# Altium project Karman Delta Arm.PrjPcb
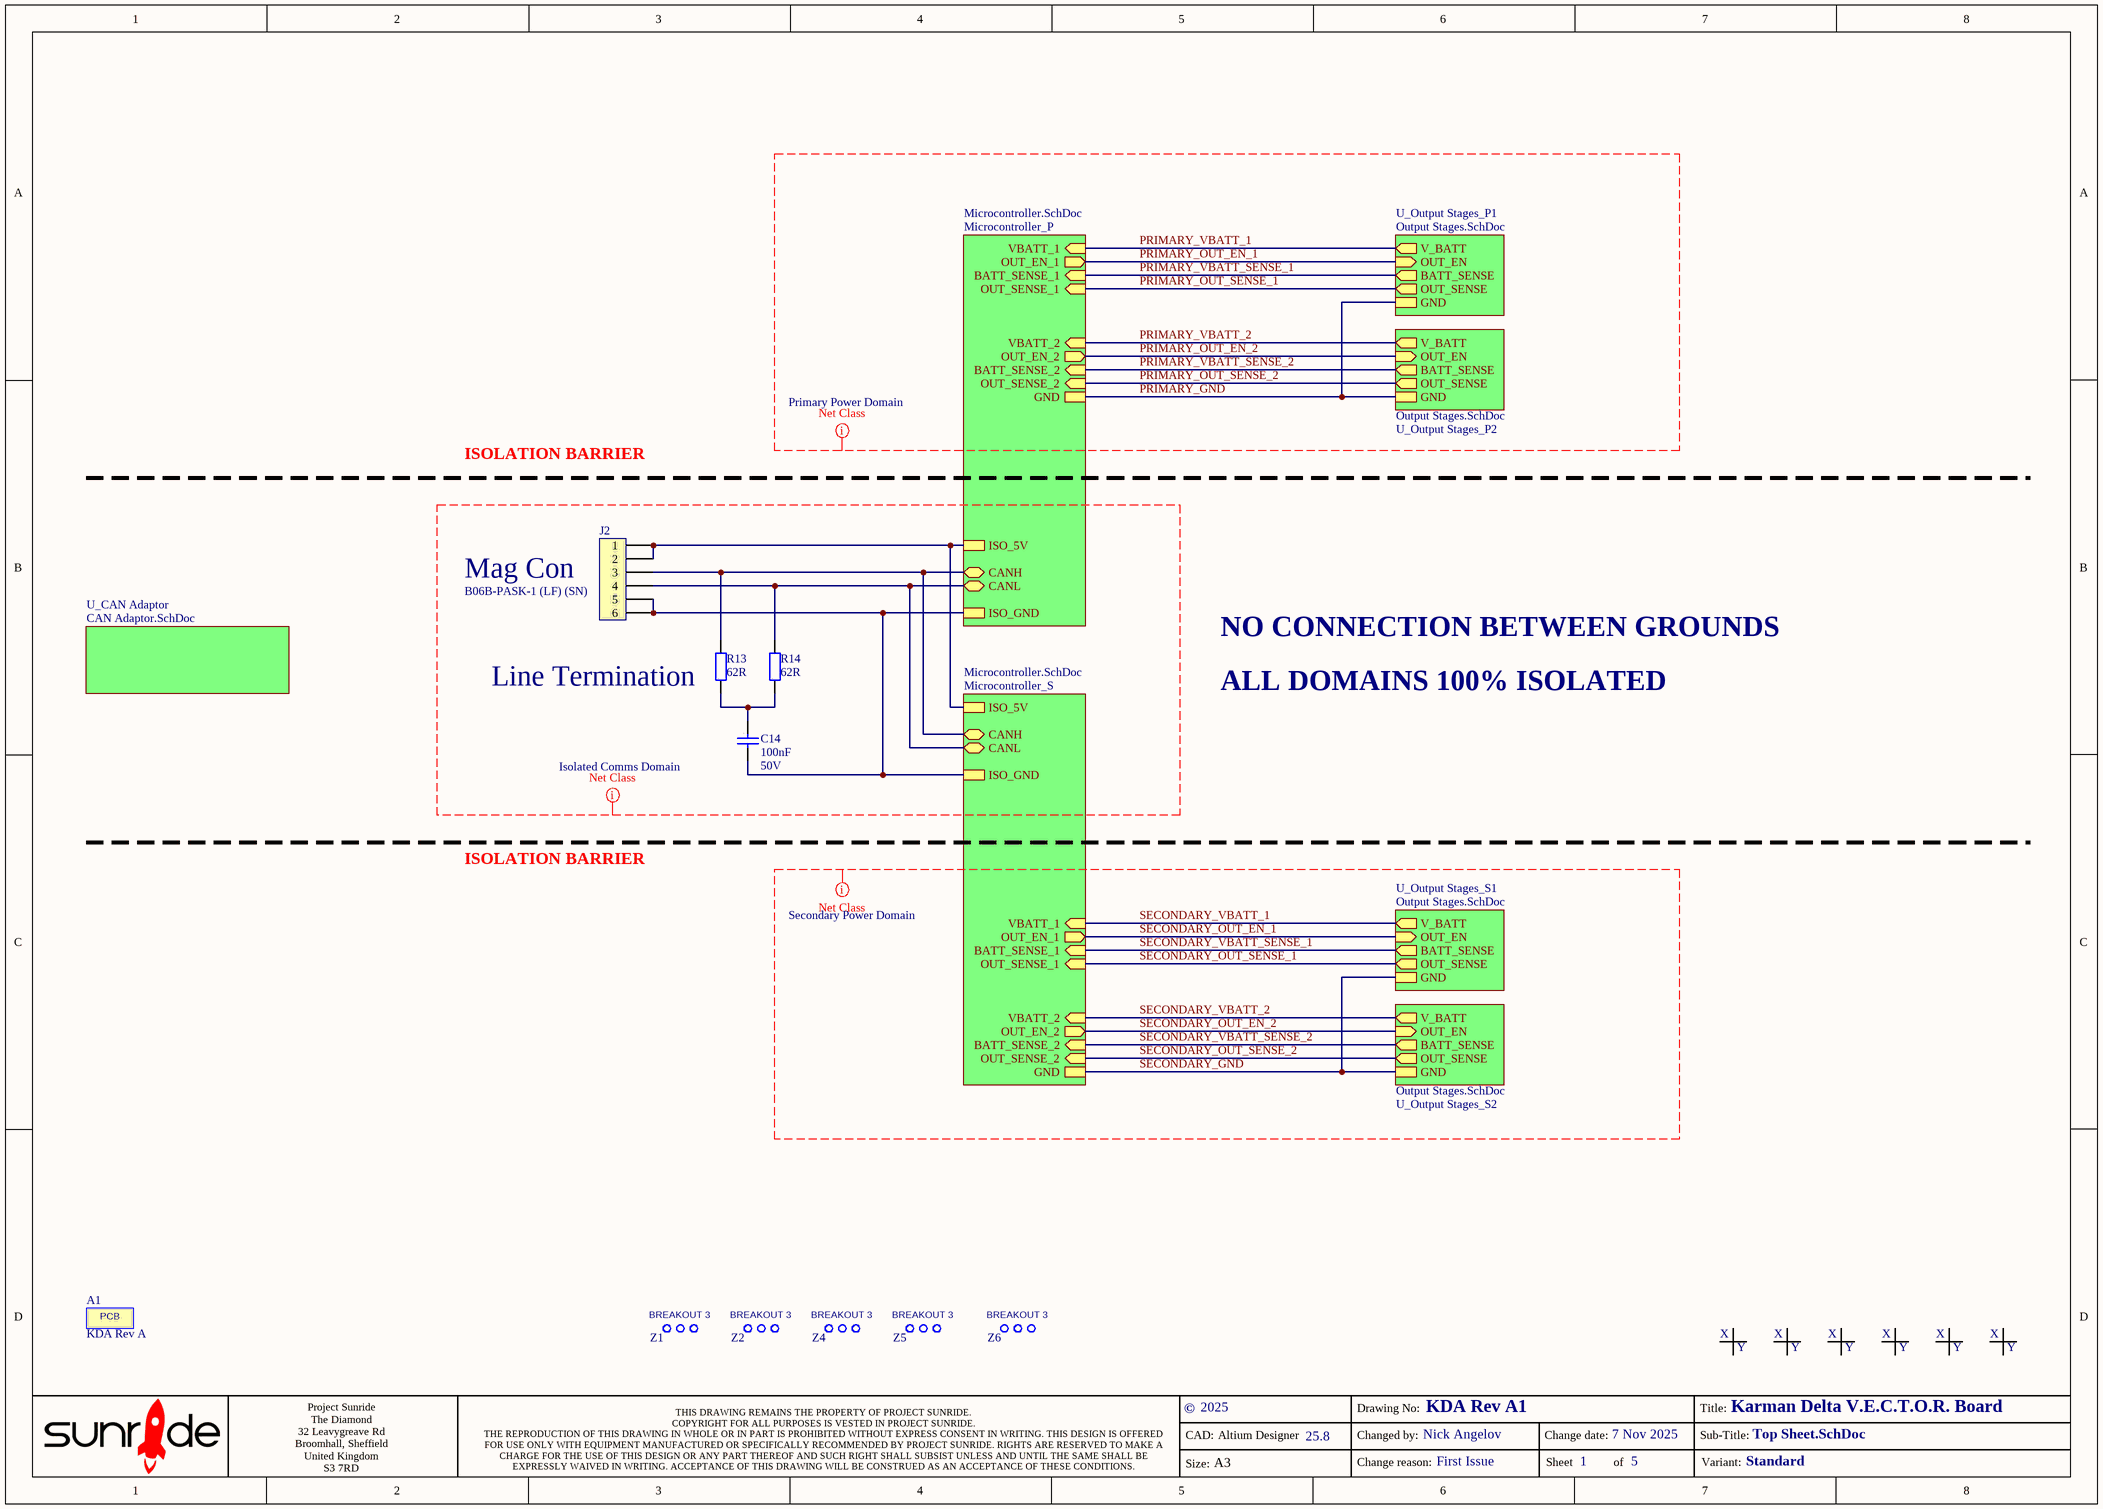
[diagram p0: Top Sheet.SchDoc]
a_AltiumVer: 25.8; a_AssemDwgNo: KDA Rev A1; a_AssemMbiNo: KDA Rev A1; a_BlockDiagramNo: -; a_BomNo: KDA Rev A1; a_CopyrightDate: 2025; a_PcbaNotesNo: -; a_PcbMbiNo: KDA Rev A1; a_PcbPartNo: KDA Rev A; a_PcbRevAuthor: Nick Angelov; a_PcbRevDate: 7 Nov 2025; a_PcbRevReason: ******; a_ReworkInstructionsNo: -; a_SchDwgNo: KDA Rev A1; a_SchRevAuthor: Nick Angelov; a_SchRevDate: 7 Nov 2025; a_SchRevReason: First Issue; a_SolderPasteStencilNo: -; a_TestSpecNo: -; a_Title: Karman Delta V.E.C.T.O.R. Board; a_Variant: Standard
5 sheets, 196 parts. Net scope: hierarchical (ports join the sheet entries above them; power ports are global).
Board files: Circular PCB - Radial.PcbDoc, PCB.PcbDoc, PCB - Rectangular.PcbDoc, PCB - Rectangular Longer.PcbDoc
Sheets:
  Top Sheet.SchDoc
    Microcontroller_P = Microcontroller.SchDoc
      U_Ancillaries = Ancillaries.SchDoc
    U_Output Stages_P1 = Output Stages.SchDoc
    U_Output Stages_P2 = Output Stages.SchDoc
    Microcontroller_S = Microcontroller.SchDoc
      U_Ancillaries = Ancillaries.SchDoc
    U_Output Stages_S1 = Output Stages.SchDoc
    U_Output Stages_S2 = Output Stages.SchDoc
    U_CAN Adaptor = CAN Adaptor.SchDoc

## Sheet Top Sheet.SchDoc
size A3; SheetNumber: 1; SheetTotal: 5

### Parts
A1  Supplier Part Number 1: KDA Rev A  [PCB]  (hidden comment: *)
C14  value 100nF  Voltage: 50V  [CAPC1608X08L]  (hidden comment: *)
FID1  *  [FIDRT]  (value not drawn)  (no BOM)
FID2  *  [FIDRT]  (value not drawn)  (no BOM)
FID3  *  [FIDRT]  (value not drawn)  (no BOM)
FID4  *  [FIDRT]  (value not drawn)  (no BOM)
FID5  *  [FIDRT]  (value not drawn)  (no BOM)
FID6  *  [FIDRT]  (value not drawn)  (no BOM)
J2  Mag Con  ManuPartNo: B06B-PASK-1 (LF) (SN)  [B06B-PASK-1]
R13  Line Termination  value 62R  [RESC1608X06L]
R14  value 62R  [RESC1608X06L]  (hidden comment: *)
Z1  *  [Breakout - 3 hole - short route]  (value not drawn)  (no BOM)
Z2  *  [Breakout - 3 hole - short route]  (value not drawn)  (no BOM)
Z4  *  [Breakout - 3 hole - short route]  (value not drawn)  (no BOM)
Z5  *  [Breakout - 3 hole - short route]  (value not drawn)  (no BOM)
Z6  *  [Breakout - 3 hole - short route]  (value not drawn)  (no BOM)

### Sub-sheets
Microcontroller_P = Microcontroller.SchDoc: OUT_EN_1 (out), OUT_EN_2 (out), BATT_SENSE_1 (in), BATT_SENSE_2 (in), VBATT_2 (in), VBATT_1 (in), OUT_SENSE_1 (in), OUT_SENSE_2 (in), CANH (bidir), CANL (bidir), GND, ISO_GND, ISO_5V
Microcontroller_S = Microcontroller.SchDoc: OUT_EN_1 (out), OUT_EN_2 (out), BATT_SENSE_1 (in), BATT_SENSE_2 (in), VBATT_2 (in), VBATT_1 (in), OUT_SENSE_1 (in), OUT_SENSE_2 (in), CANH (bidir), CANL (bidir), GND, ISO_GND, ISO_5V
U_CAN Adaptor = CAN Adaptor.SchDoc: no entries
U_Output Stages_P1 = Output Stages.SchDoc: OUT_EN (in), BATT_SENSE (out), V_BATT (out), OUT_SENSE (out), GND
U_Output Stages_P2 = Output Stages.SchDoc: OUT_EN (in), BATT_SENSE (out), V_BATT (out), OUT_SENSE (out), GND
U_Output Stages_S1 = Output Stages.SchDoc: OUT_EN (in), BATT_SENSE (out), V_BATT (out), OUT_SENSE (out), GND
U_Output Stages_S2 = Output Stages.SchDoc: OUT_EN (in), BATT_SENSE (out), V_BATT (out), OUT_SENSE (out), GND

### Nets
CANH: J2.3 R13.2 ; sheet Microcontroller_P/CANH, sheet Microcontroller_S/CANH
CANL: J2.4 R14.2 ; sheet Microcontroller_P/CANL, sheet Microcontroller_S/CANL
ISO_5V: J2.1 J2.2 ; sheet Microcontroller_P/ISO_5V, sheet Microcontroller_S/ISO_5V
ISO_GND: C14.2 J2.5 J2.6 ; sheet Microcontroller_P/ISO_GND, sheet Microcontroller_S/ISO_GND
PRIMARY_GND: sheet Microcontroller_P/GND, sheet U_Output Stages_P1/GND, sheet U_Output Stages_P2/GND  [project net GND]
PRIMARY_OUT_EN_1: sheet Microcontroller_P/OUT_EN_1, sheet U_Output Stages_P1/OUT_EN
PRIMARY_OUT_EN_2: sheet Microcontroller_P/OUT_EN_2, sheet U_Output Stages_P2/OUT_EN
PRIMARY_OUT_SENSE_1: sheet Microcontroller_P/OUT_SENSE_1, sheet U_Output Stages_P1/OUT_SENSE
PRIMARY_OUT_SENSE_2: sheet Microcontroller_P/OUT_SENSE_2, sheet U_Output Stages_P2/OUT_SENSE
PRIMARY_VBATT_1: sheet Microcontroller_P/VBATT_1, sheet U_Output Stages_P1/V_BATT
PRIMARY_VBATT_2: sheet Microcontroller_P/VBATT_2, sheet U_Output Stages_P2/V_BATT
PRIMARY_VBATT_SENSE_1: sheet Microcontroller_P/BATT_SENSE_1, sheet U_Output Stages_P1/BATT_SENSE
PRIMARY_VBATT_SENSE_2: sheet Microcontroller_P/BATT_SENSE_2, sheet U_Output Stages_P2/BATT_SENSE
SECONDARY_GND: sheet Microcontroller_S/GND, sheet U_Output Stages_S1/GND, sheet U_Output Stages_S2/GND  [project net GND]
SECONDARY_OUT_EN_1: sheet Microcontroller_S/OUT_EN_1, sheet U_Output Stages_S1/OUT_EN
SECONDARY_OUT_EN_2: sheet Microcontroller_S/OUT_EN_2, sheet U_Output Stages_S2/OUT_EN
SECONDARY_OUT_SENSE_1: sheet Microcontroller_S/OUT_SENSE_1, sheet U_Output Stages_S1/OUT_SENSE
SECONDARY_OUT_SENSE_2: sheet Microcontroller_S/OUT_SENSE_2, sheet U_Output Stages_S2/OUT_SENSE
SECONDARY_VBATT_1: sheet Microcontroller_S/VBATT_1, sheet U_Output Stages_S1/V_BATT
SECONDARY_VBATT_2: sheet Microcontroller_S/VBATT_2, sheet U_Output Stages_S2/V_BATT
SECONDARY_VBATT_SENSE_1: sheet Microcontroller_S/BATT_SENSE_1, sheet U_Output Stages_S1/BATT_SENSE
SECONDARY_VBATT_SENSE_2: sheet Microcontroller_S/BATT_SENSE_2, sheet U_Output Stages_S2/BATT_SENSE
NetC14_1: C14.1 R13.1 R14.1

### Layout directives
net class Primary Power Domain: PRIMARY_GND, PRIMARY_OUT_EN_1, PRIMARY_OUT_EN_2, PRIMARY_OUT_SENSE_1, PRIMARY_OUT_SENSE_2, PRIMARY_VBATT_1, PRIMARY_VBATT_2, PRIMARY_VBATT_SENSE_1, PRIMARY_VBATT_SENSE_2
net class Secondary Power Domain: SECONDARY_GND, SECONDARY_OUT_EN_1, SECONDARY_OUT_EN_2, SECONDARY_OUT_SENSE_1, SECONDARY_OUT_SENSE_2, SECONDARY_VBATT_1, SECONDARY_VBATT_2, SECONDARY_VBATT_SENSE_1, SECONDARY_VBATT_SENSE_2
net class Isolated Comms Domain: (no net found under the mark)

### Notes on the sheet
- ISOLATION BARRIER
- NO CONNECTION BETWEEN GROUNDS
- ALL DOMAINS 100% ISOLATED
- ©
- CAD:
- Altium Designer
- Changed by:
- Drawing No:
- Change date:
- Title:
- Sub-Title:
- Project Sunride
  The Diamond
  32 Leavygreave Rd
  Broomhall, Sheffield
  United Kingdom
  S3 7RD
- THIS DRAWING REMAINS THE PROPERTY OF PROJECT SUNRIDE.
  COPYRIGHT FOR ALL PURPOSES IS VESTED IN PROJECT SUNRIDE.
  THE REPRODUCTION OF THIS DRAWING IN WHOLE OR IN PART IS PROHIBITED WITHOUT EXPRESS CONSENT IN WRITING. THIS DESIGN IS OFFERED FOR USE ONLY WITH EQUIPMENT MANUFACTURED OR SPECIFICALLY RECOMMENDED BY PROJECT SUNRIDE. RIGHTS ARE RESERVED TO MAKE A CHARGE FOR THE USE OF THIS DESIGN OR ANY PART THEREOF AND SUCH RIGHT SHALL SUBSIST UNLESS AND UNTIL THE SAME SHALL BE EXPRESSLY WAIVED IN WRITING. ACCEPTANCE OF THIS DRAWING WILL BE CONSTRUED AS AN ACCEPTANCE OF THESE CONDITIONS.
- Size:
- A3
- Change reason:
- Sheet
- of
- Variant:
- (in symbol Misc FIDT) X; Y
- (in symbol Misc_Breakout - 3 hole - short route) BREAKOUT 3

### Library data of the parts
A1 = Misc PCB: PCB (Bare Board); Class: PCB BOM Entry; Source: Misc PCB; Created: 31/05/2013; Last_Updated: 31/05/2013
C14 = FEC882-0023: Capacitor MLC 100nF 50V X7R 10% CAPC1608X08M; Manufacturer: Murata; ManuPartNo: GRM188R71H104KA93D; Cost 1+: 0.064; Cost 1K+: 0.039; Life: V; Source: FEC882-0023; Dielectric: X7R; Tolerance: 10%; Class: Capacitor MLC; RoHS: Y; Created: 25/01/2013; Last_Updated: 25/01/2013; Supplier 1: Farnell; Supplier Part Number 1: 8820023
FID1-FID6 = Misc FIDT: Fiducial 1mm Dot Component Side; Class: Fiducial Dot; Source: Misc FIDT; Supplier 1: Misc; Supplier Part Number 1: FIDT; Created: 31/05/2013; Last_Updated: 31/05/2013
J2 = FEC183-0743: Connector 6 Way Vertical B06B-PASK-1 (LF) (SN) 2mm Pitch; Manufacturer: JST; Cost 1+: 0.55; Cost 1K+: 0.2; Life: V; Source: FEC183-0743; Pin Count: 6; Orient: Vertical; Supplier 1: Farnell; Supplier Part Number 1: 1830743; Pitch: 2mm; Class: Connector; RoHS: Y; Created: 21/06/2013; Last_Updated: 21/06/2013
R13 R14 = Mouser603-RC0603FR-0762RL: SMD Chip Resistor, Thick Film, 62 ohm, 75V, 0603 [1608 Metric], 100mW, ± 1%, RC Series; Manufacturer: Yageo; Cost 1+: 0.074; Cost 1K+: 0.002; Life: V; Source: Mouser603-RC0603FR-0762RL; Voltage: 75V; Power: 100mW; ManuPartNo: RC0603FR-0762RL; Supplier 1: Mouser; Supplier Part Number 1: 603-RC0603FR-0762RL; Tolerance: 1%; Class: Resistor; RoHS: Y; Created: 08/06/2018; Last_Updated: 08/06/2018; ComponentLink1Description: Datasheet; ComponentLink1URL: C:\Altium SANDBOX\Component Database\Datasheet\Yageo RC_L Series.pdf
Z1 Z2 Z4-Z6 = Misc_Breakout - 3 hole - short route: Breakout - 3 hole - short route; Class: Free pads; Source: Misc_Breakout - 3 hole - short route; Supplier 1: Misc; Created: 14/12/2020; Last_Updated: 14/12/2020

## Sheet Microcontroller.SchDoc
size A3; SheetNumber: 2; SheetTotal: 4
Used 2 times, as channels Microcontroller_P, Microcontroller_S. Parts and nets are listed once, with the designators drawn on the sheet.
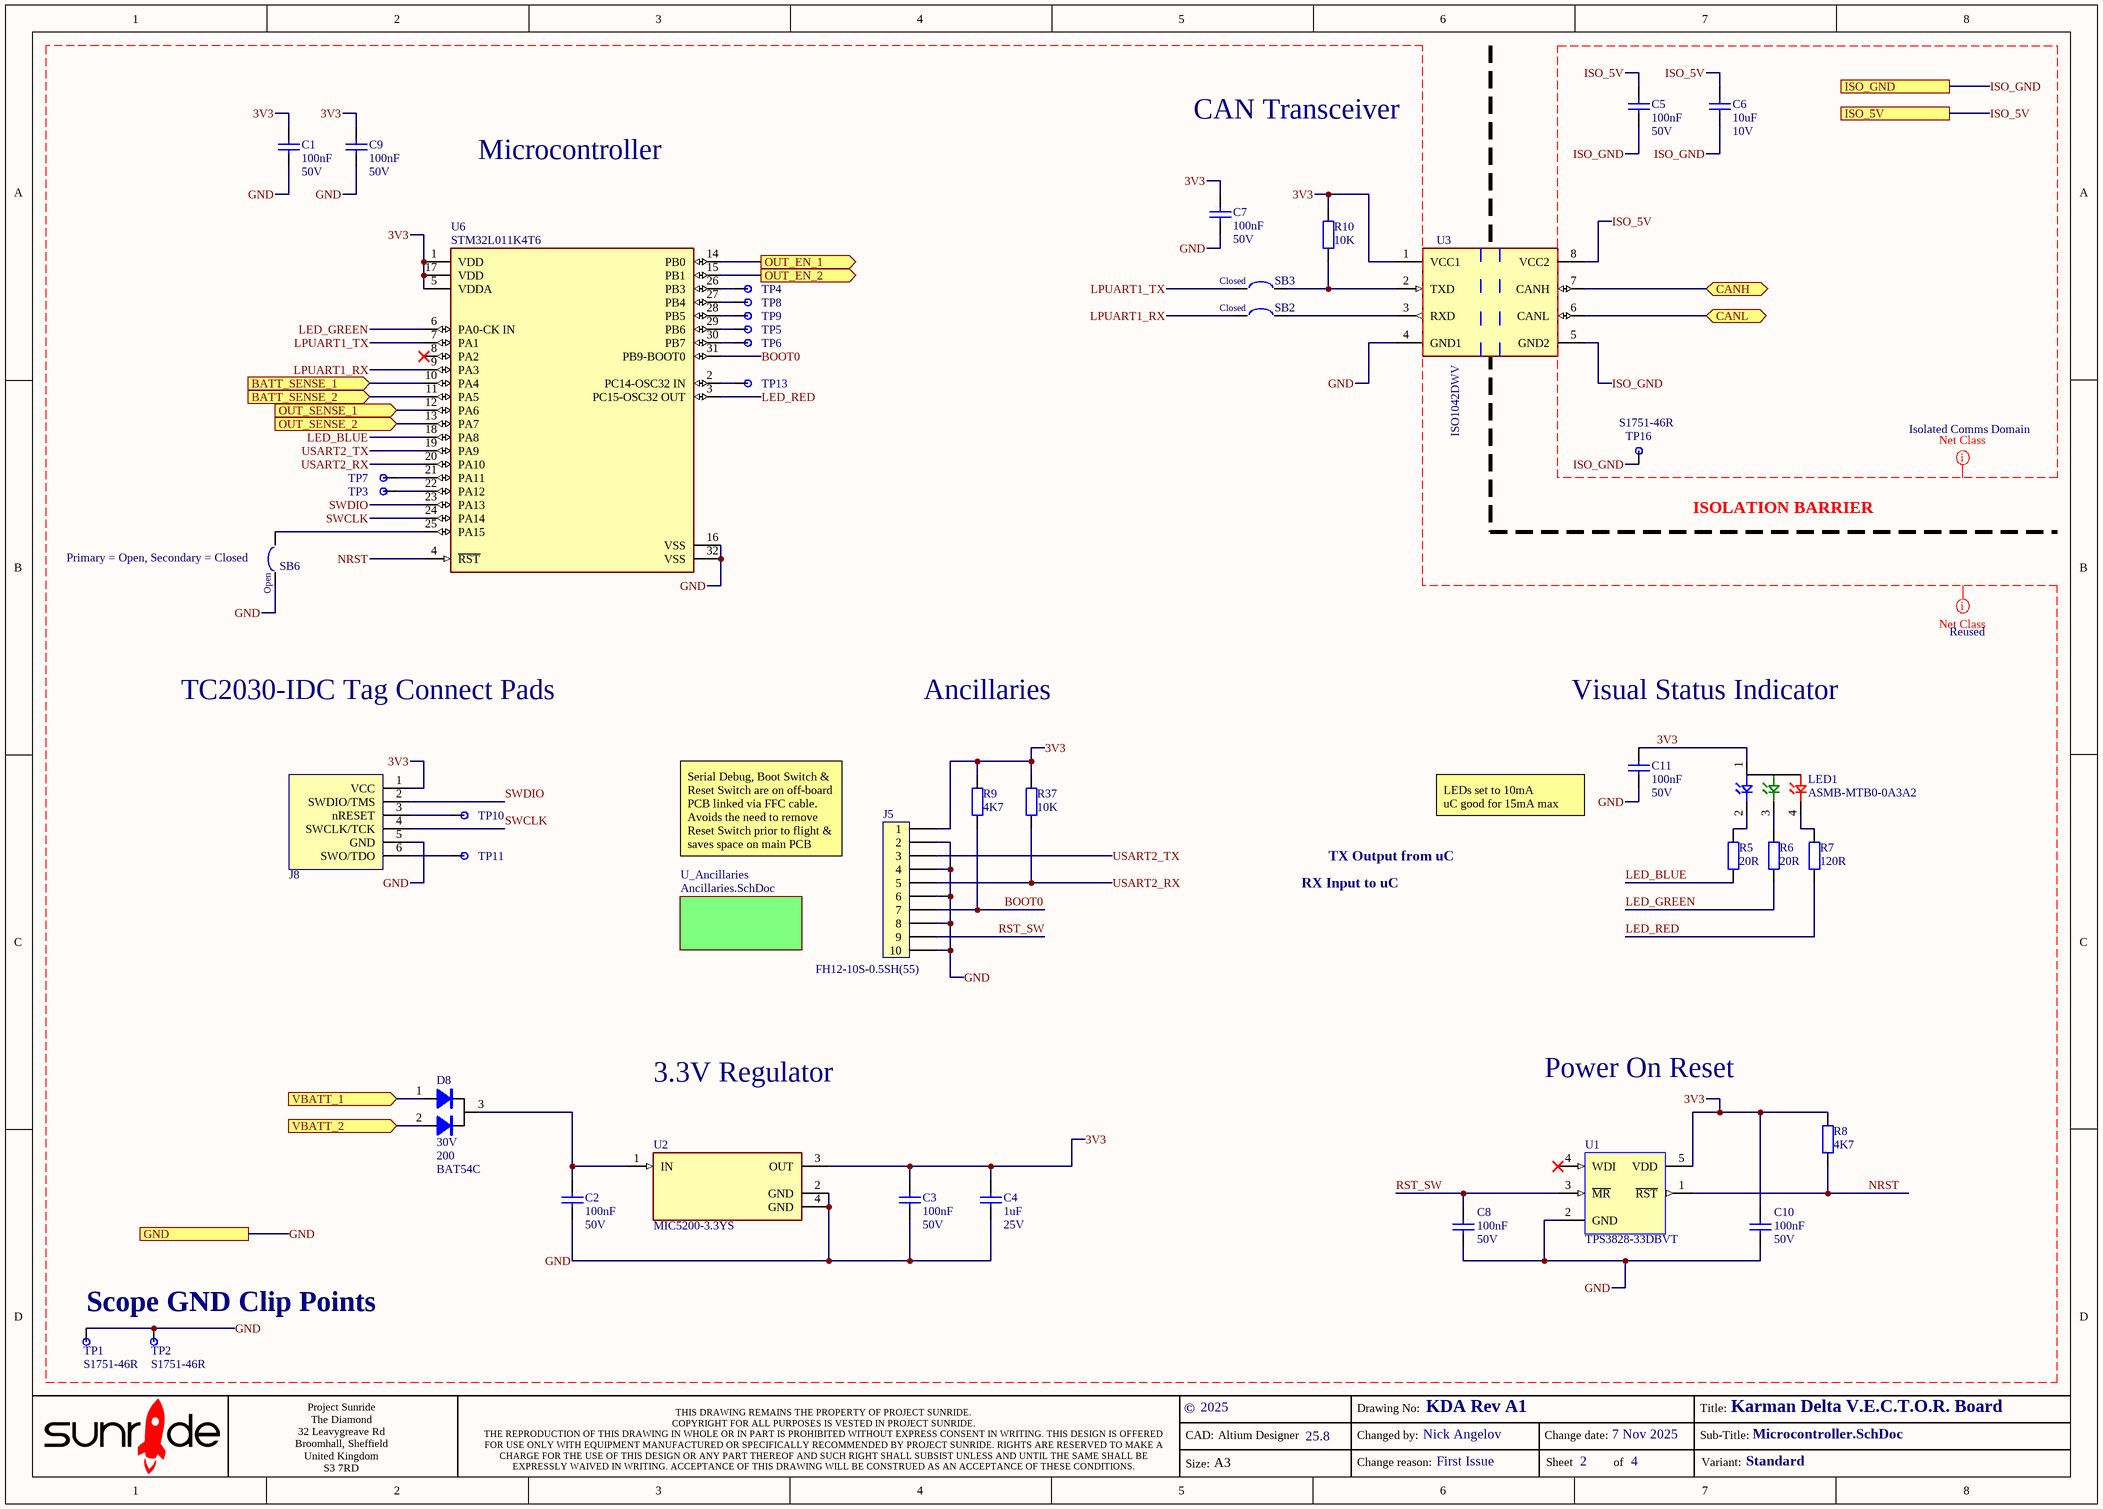
[diagram p1: Microcontroller.SchDoc]

### Parts
C1  value 100nF  Voltage: 50V  [CAPC1608X08L]  (hidden comment: *)
C2  value 100nF  Voltage: 50V  [CAPC1608X08L]  (hidden comment: *)
C3  value 100nF  Voltage: 50V  [CAPC1608X08L]  (hidden comment: *)
C4  value 1uF  Voltage: 25V  [CAPC1608X08L]  (hidden comment: *)
C5  value 100nF  Voltage: 50V  [CAPC1608X08L]  (hidden comment: *)
C6  value 10uF  Voltage: 10V  [CAPC2012X15M]  (hidden comment: *)
C7  value 100nF  Voltage: 50V  [CAPC1608X08L]  (hidden comment: *)
C8  value 100nF  Voltage: 50V  [CAPC1608X08L]  (hidden comment: *)
C9  value 100nF  Voltage: 50V  [CAPC1608X08L]  (hidden comment: *)
C10  value 100nF  Voltage: 50V  [CAPC1608X08L]  (hidden comment: *)
C11  value 100nF  Voltage: 50V  [CAPC1608X08L]  (hidden comment: *)
D8  Vr (V): 30V  If (mA): 200  ManuPartNo: BAT54C  [SOT95P237X112-3M]  (hidden comment: *)
J5  Ancillaries  ManuPartNo: FH12-10S-0.5SH(55)  [FH12-10S-0_5SH]
J8  TC2030-IDC Tag Connect Pads  [TC2030-IDC-NL]  (no BOM)
LED1  Visual Status Indicator  [ASMB-MTB0-0A3A2]
R5  value 20R  [RESC1608X06L]  (hidden comment: *)
R6  value 20R  [RESC1608X06L]  (hidden comment: *)
R7  value 120R  [RESC1608X06L]  (hidden comment: *)
R8  value 4K7  [RESC1608X06L]  (hidden comment: RESISTOR)
R9  value 4K7  [RESC1608X06L]  (hidden comment: RESISTOR)
R10  value 10K  [RESC1608X06L]  (hidden comment: RESISTOR)
R37  value 10K  [RESC1608X06L]  (hidden comment: RESISTOR)
SB2  Solder Blob Closed  [0603SolderLinkClosed]  (value not drawn)  (no BOM)
SB3  Solder Blob Closed  [0603SolderLinkClosed]  (value not drawn)  (no BOM)
SB6  Primary = Open, Secondary = Closed  [0603SolderLinkOpen]  (no BOM)
TP1  GND  [S1751-46R]  (value not drawn)
TP2  GND  [S1751-46R]  (value not drawn)
TP3  TMS  [TP1]  (value not drawn)  (no BOM)
TP4  TMS  [TP1]  (value not drawn)  (no BOM)
TP5  TMS  [TP1]  (value not drawn)  (no BOM)
TP6  TMS  [TP1]  (value not drawn)  (no BOM)
TP7  TMS  [TP1]  (value not drawn)  (no BOM)
TP8  TMS  [TP1]  (value not drawn)  (no BOM)
TP9  TMS  [TP1]  (value not drawn)  (no BOM)
TP10  TMS  [TP1]  (value not drawn)  (no BOM)
TP11  TMS  [TP1]  (value not drawn)  (no BOM)
TP13  TMS  [TP1]  (value not drawn)  (no BOM)
TP16  GND  [S1751-46R]  (value not drawn)
U1  Power On Reset  ManuPartNo: TPS3828-33DBVT  [SOT95P280X145-5L]
U2  MIC5200-3.3YS  [FP-SOT223-3LD-PL-1-IPC_C]
U3  CAN Transceiver  Manuf Part No: ISO1042DWV  [FP-DWV0008A-IPC_C]
U6  Microcontroller  Manufacturer Part Number: STM32L011K4T6  [FP-LQFP32-5V-MFG]

### Sub-sheets
U_Ancillaries = Ancillaries.SchDoc: no entries

### Ports
BATT_SENSE_1 (in), BATT_SENSE_2 (in), CANH (bidir), CANL (bidir), GND, ISO_5V, ISO_GND, OUT_EN_1 (out), OUT_EN_2 (out), OUT_SENSE_1 (in), OUT_SENSE_2 (in), VBATT_1 (in), VBATT_2 (in)

### Nets
3V3: C1.1 C3.1 C4.1 C7.1 C9.1 C10.1 C11.1 J5.1 J8.1(VCC) LED1.1(A) R8.2 R9.2 R10.2 R37.2 U1.5(VDD) U2.3(OUT) U3.1(VCC1) U6.1(VDD) U6.5(VDDA) U6.17(VDD)
BATT_SENSE_1: U6.10(PA4) ; port BATT_SENSE_1
BATT_SENSE_2: U6.11(PA5) ; port BATT_SENSE_2
BOOT0: J5.7 R9.1 U6.31(PB9-BOOT0)
CANH: U3.7(CANH) ; port CANH
CANL: U3.6(CANL) ; port CANL
GND: C1.2 C2.2 C3.2 C4.2 C7.2 C8.2 C9.2 C10.2 C11.2 J5.2 J5.4 J5.6 J5.8 J5.10 J8.5(GND) SB6.1 TP1.1 TP2.1 U1.2(GND) U2.2(GND) U2.4(GND) U3.4(GND1) U6.16(VSS) U6.32(VSS) ; port GND
ISO_5V: C5.1 C6.1 U3.8(VCC2) ; port ISO_5V
ISO_GND: C5.2 C6.2 TP16.1 U3.5(GND2) ; port ISO_GND
LED_BLUE: R5.1 U6.18(PA8)
LED_GREEN: R6.1 U6.6(PA0-CK_IN)
LED_RED: R7.1 U6.3(PC15-OSC32_OUT)
LPUART1_RX: SB2.1 U6.9(PA3)
LPUART1_TX: SB3.1 U6.7(PA1)
NRST: R8.1 U1.1(~{RST}) U6.4(~{RST})
OUT_EN_1: U6.14(PB0) ; port OUT_EN_1
OUT_EN_2: U6.15(PB1) ; port OUT_EN_2
OUT_SENSE_1: U6.12(PA6) ; port OUT_SENSE_1
OUT_SENSE_2: U6.13(PA7) ; port OUT_SENSE_2
RST_SW: C8.1 J5.9 U1.3(~{MR})
SWCLK: J8.4(SWCLK/TCK) U6.24(PA14)
SWDIO: J8.2(SWDIO/TMS) U6.23(PA13)
USART2_RX: J5.5 R37.1 U6.20(PA10)
USART2_TX: J5.3 U6.19(PA9)
VBATT_1: D8.1 ; port VBATT_1
VBATT_2: D8.2 ; port VBATT_2
NetC2_1: C2.1 D8.3 U2.1(IN)
NetJ8_3: J8.3(nRESET) TP10.1
NetJ8_6: J8.6(SWO/TDO) TP11.1
NetLED1_2: LED1.2(B) R5.2
NetLED1_3: LED1.3(G) R6.2
NetLED1_4: LED1.4(R) R7.2
NetR10_1: R10.1 SB3.2 U3.2(TXD)
NetSB2_2: SB2.2 U3.3(RXD)
NetSB6_2: SB6.2 U6.25(PA15)
NetTP3_1: TP3.1 U6.22(PA12)
NetTP4_1: TP4.1 U6.26(PB3)
NetTP5_1: TP5.1 U6.29(PB6)
NetTP6_1: TP6.1 U6.30(PB7)
NetTP7_1: TP7.1 U6.21(PA11)
NetTP8_1: TP8.1 U6.27(PB4)
NetTP9_1: TP9.1 U6.28(PB5)
NetTP13_1: TP13.1 U6.2(PC14-OSC32_IN)

Not connected (* = marked no-connect by the designer): U1 4(WDI)*; U6 8(PA2)*

### Channels
Microcontroller_P: designators end in A; ports BATT_SENSE_1=PRIMARY_VBATT_SENSE_1 BATT_SENSE_2=PRIMARY_VBATT_SENSE_2 CANH=CANH CANL=CANL GND=GND ISO_5V=ISO_5V ISO_GND=ISO_GND OUT_EN_1=PRIMARY_OUT_EN_1 OUT_EN_2=PRIMARY_OUT_EN_2 OUT_SENSE_1=PRIMARY_OUT_SENSE_1 OUT_SENSE_2=PRIMARY_OUT_SENSE_2 VBATT_1=PRIMARY_VBATT_1 VBATT_2=PRIMARY_VBATT_2
Microcontroller_S: designators end in B; ports BATT_SENSE_1=SECONDARY_VBATT_SENSE_1 BATT_SENSE_2=SECONDARY_VBATT_SENSE_2 CANH=CANH CANL=CANL GND=GND ISO_5V=ISO_5V ISO_GND=ISO_GND OUT_EN_1=SECONDARY_OUT_EN_1 OUT_EN_2=SECONDARY_OUT_EN_2 OUT_SENSE_1=SECONDARY_OUT_SENSE_1 OUT_SENSE_2=SECONDARY_OUT_SENSE_2 VBATT_1=SECONDARY_VBATT_1 VBATT_2=SECONDARY_VBATT_2

### Layout directives
net class Isolated Comms Domain: ISO_5V, ISO_GND
net class Reused: 3V3, BOOT0, GND, LED_BLUE, LED_GREEN, LED_RED, LPUART1_RX, LPUART1_TX, NRST, RST_SW, SWCLK, SWDIO, USART2_RX, USART2_TX

### Notes on the sheet
- ISOLATION BARRIER
- Serial Debug, Boot Switch & Reset Switch are on off-board PCB linked via FFC cable.
  Avoids the need to remove Reset Switch prior to flight & saves space on main PCB
- TX Output from uC
- LEDs set to 10mA
  uC good for 15mA max
- RX Input to uC
- 3.3V Regulator
- Scope GND Clip Points
- ©
- CAD:
- Altium Designer
- Changed by:
- Drawing No:
- Change date:
- Title:
- Sub-Title:
- Project Sunride
  The Diamond
  32 Leavygreave Rd
  Broomhall, Sheffield
  United Kingdom
  S3 7RD
- THIS DRAWING REMAINS THE PROPERTY OF PROJECT SUNRIDE.
  COPYRIGHT FOR ALL PURPOSES IS VESTED IN PROJECT SUNRIDE.
  THE REPRODUCTION OF THIS DRAWING IN WHOLE OR IN PART IS PROHIBITED WITHOUT EXPRESS CONSENT IN WRITING. THIS DESIGN IS OFFERED FOR USE ONLY WITH EQUIPMENT MANUFACTURED OR SPECIFICALLY RECOMMENDED BY PROJECT SUNRIDE. RIGHTS ARE RESERVED TO MAKE A CHARGE FOR THE USE OF THIS DESIGN OR ANY PART THEREOF AND SUCH RIGHT SHALL SUBSIST UNLESS AND UNTIL THE SAME SHALL BE EXPRESSLY WAIVED IN WRITING. ACCEPTANCE OF THIS DRAWING WILL BE CONSTRUED AS AN ACCEPTANCE OF THESE CONDITIONS.
- Size:
- A3
- Change reason:
- Sheet
- of
- Variant:
- (in symbol Solder Blob Closed) Closed
- (in symbol Solder Blob Open) Open

### Library data of the parts
C1-C3 C5 C7-C11 = FEC882-0023: as C14 on sheet Top Sheet; Source: FEC882-0023; Dielectric: X7R; Supplier 1: Farnell; Supplier Part Number 1: 8820023; Tolerance: 10%; Class: Capacitor MLC; RoHS: Y; Created: 25/01/2013; Last_Updated: 25/01/2013
C4 = FEC3013414: Capacitor MLC 1uF 25V X7R 10% CAPC1608X08M; Manufacturer: Samsung; ManuPartNo: CL10B105KA8NFNC; Cost 1+: 0.0261; Cost 1K+: 0.0112; Life: V; Source: FEC3013414; Dielectric: X7R; Supplier 1: Farnell; Supplier Part Number 1: 3013414; Tolerance: 10%; Class: Capacitor MLC; RoHS: Y; Created: 11/05/2021; Last_Updated: 11/05/2021; ComponentLink1Description: Datasheet; ComponentLink1URL: C:\Altium SANDBOX\Component Database\Datasheet\2710598.pdf
C6 = Mouser81-GRM21BR71A106KE51: Capacitor MLC 10uF10V X7R 10% CAPC2012X15M; Manufacturer: Murata; ManuPartNo: GRM21BR71A106KE51L; Cost 1+: 0.189; Cost 1K+: 0.046; Life: V; Source: Mouser81-GRM21BR71A106KE51; Dielectric: X7R; Supplier 1: Mouser; Supplier Part Number 1: 81-GRM21BR71A106KE51; Tolerance: 10%; Class: Capacitor MLC; RoHS: Y; Created: 21/12/2016; Last_Updated: 21/12/2016
D8 = FEC146-7518: Diode Schottky BAT54C SOT-23; Manufacturer: Fairchild; Ptot (mW): 290; Cost 1+: 0.117; Cost 1K+: 0.0297; Vf: 0.8V; Life: V; Source: FEC146-7518; Supplier 1: Farnell; Supplier Part Number 1: 1467518; Class: Diode Schottky; RoHS: Y; Created: 16/12/2013; Last_Updated: 26/06/2018; ComponentLink1Description: Datasheet; ComponentLink1URL: C:\Altium SANDBOX\Component Database\Datasheet\BAT54 Fairchild.pdf
J5 = FEC1324540: Connector 10W FFC/FPC 0.5mm SM ZIF; Manufacturer: Hirose; Orient: Horizontal; Cost 1+: 1.02; Cost 1K+: 0.563; Life: V; Source: FEC1324540; Pin Count: 10; Supplier 1: Farnell; Supplier Part Number 1: 1324540; Class: Connector; RoHS: Y; Created: 28/02/2020; Last_Updated: 28/02/2020; ComponentLink1Description: Datasheet; ComponentLink1URL: C:\Altium SANDBOX\Component Database\Datasheet\Hirose FH12 Series.pdf
J8 = TC2030-IDC-NL: TC2030 Tag Connect Programmer Connection - Non BOM part; Orient: Vertical; Life: V; Source: TC2030-IDC-NL; Pin Count: 6; Manufacturer: Tag Connect; RoHS: Y; Created: 28/09/2025; Last_Updated: 28/09/2025; ComponentLink1Description: Datasheet; ComponentLink1URL: C:\Altium SANDBOX\Component Database\Datasheet\TC2030-CTX.pdf
LED1 = FEC2401105: LED RGB, SMD, 2.4mm, 115 °; Manufacturer: Wurth; IF Max (mA): 20; View Angle: 115; Cost 1+: 0.278; Cost 1K+: 0.141; Life: V; Source: FEC2401105; ManuPartNo: ASMB-MTB0-0A3A2; IF Typ (mA): 20; Supplier 1: Farnell; Supplier Part Number 1: 2401105; Class: LED; RoHS: Y; Created: 09/03/2018; Last_Updated: 09/03/2018; ComponentLink1Description: Datasheet; ComponentLink1URL: C:\Altium SANDBOX\Component Database\Datasheet\2343968.pdf
R5 R6 = FEC933-0798: Resistor 20R 1% 50V RESC1608X06M; Manufacturer: Multicomp; ManuPartNo: MC 0.063W 0603 1% 20R; Cost 1+: 0.021; Cost 1K+: 0.015; Life: V; Source: FEC933-0798; Voltage: 50V; Supplier 1: Farnell; Supplier Part Number 1: 9330798; Tolerance: 1%; Class: Resistor; RoHS: Y; Created: 23/01/2013; Last_Updated: 23/01/2013
R7 = FEC933-0496: Resistor 120R 1% 50V RESC1608X06M; Manufacturer: Multicomp; ManuPartNo: MC 0.063W 0603 1% 120R; Cost 1+: 0.021; Cost 1K+: 0.015; Life: V; Source: FEC933-0496; Voltage: 50V; Supplier 1: Farnell; Supplier Part Number 1: 9330496; Tolerance: 1%; Class: Resistor; RoHS: Y; Created: 23/01/2013; Last_Updated: 23/01/2013
R8 R9 = FEC933-1247: Resistor 4K7 1% 50V RESC1608X06M; Manufacturer: Multicomp; ManuPartNo: MC 0.063W 0603 1% 4K7; Cost 1+: 0.021; Cost 1K+: 0.015; Life: V; Source: FEC933-1247; Voltage: 50V; Supplier 1: Farnell; Supplier Part Number 1: 9331247; Tolerance: 1%; Class: Resistor; RoHS: Y; Created: 23/01/2013; Last_Updated: 23/01/2013
R10 R37 = PanasonicERA3AEB103V: SMD Chip Resistor, Thin Film, 10 kohm, 75 V, 0603 [1608 Metric], 100 mW, ± 0.1%, ERA3A Series; Voltage: 75V; Cost 1+: 0.237; Cost 1K+: 0.053; Power: 100mW; Source: PanasonicERA3AEB103V; Manufacturer: Panasonic; ManuPartNo: ERA3AEB103V; Supplier 1: Farnell; Supplier Part Number 1: 1577619; Tolerance: 0.1%; Class: Resistor; RoHS: Y; Life: V; Created: 27/02/2018; Last_Updated: 27/02/2018; ComponentLink1Description: Datasheet; ComponentLink1URL: C:\Altium SANDBOX\Component Database\Datasheet\Panasonic Resistors.pdf
SB2 SB3 = Solder Blob Closed: Solder Blob - Closed 0603 SM pads; Life: V; Source: Solder Blob Closed; Pin Count: 2; RoHS: Y; Created: 13/10/2017; Last_Updated: 13/10/2017
SB6 = Solder Blob Open: Solder Blob - Open 0603 SM pads; Life: V; Source: Solder Blob Open; Pin Count: 2; RoHS: Y; Created: 13/10/2017; Last_Updated: 13/10/2017
TP1 TP2 TP16 = FEC2293786: PCB Test Point S1751 Series, Surface Mount; Manufacturer: Harwin; Orient: Vertical; Cost 1+: 0.134; Cost 1K+: 0.106; Class: Connector; Life: V; Source: FEC2293786; ManuPartNo: S1751-46R; Pin Count: 1; Supplier 1: Farnell; Supplier Part Number 1: 2293786; RoHS: Y; Created: 16/10/2017; Last_Updated: 01/12/2017; ComponentLink1Description: Datasheet; ComponentLink1URL: C:\Altium SANDBOX\Component Database\Datasheet\S1751-46R.pdf
TP3-TP11 TP13 = Misc TP1: Testpoint 1mm dia. Component side, no silk; Source: Misc TP1; Class: Testpoint; Created: 26/01/2013; Last_Updated: 26/01/2013; Supplier 1: Misc; Supplier Part Number 1: TP1
U1 = FEC845-7255: IC Supply Voltage Monitor, 2.93V TPS3828-33DBVT SOT23-5; Manufacturer: Texas; Cost 1+: 1.08; Cost 1K+: 0.73; Class: IC Sensor; Life: V; Source: FEC845-7255; Supplier 1: Farnell; Supplier Part Number 1: 8457255; RoHS: Y; Created: 10/06/2013; Last_Updated: 10/06/2013; ComponentLink1Description: Datasheet; ComponentLink1URL: C:\Altium SANDBOX\Component Database\Datasheet\TPS3828.pdf
U2 = CMP-06324-000085-1: IC REG LIN 3.3V 100MA SOT223-3; Max Input Voltage: 26V; Output Type: Fixed; Number of Regulators: 1; Dropout Voltage: 230mV; Min Input Voltage: 2.5V; Max Operating Temperature: 125°C; Lead Free: Lead Free; Output Current: 100mA; Mount: Surface Mount; Min Current Limit: 100mA; Min Operating Temperature: -40°C; Case/Package: SOT-223; Number of Pins: 3; Packaging: Rail/Tube; Nominal Output Voltage: 3.3V; REACH SVHC: No SVHC; Output Voltage: 3.3V
U3 = CMP-04872-000132-1: IC TRANSCEIVER FULL 1/1 8SOIC; RoHS Compliant: Yes
U6 = CMP-12105-000012-1: IC MCU 32BIT 16KB FLASH 32LQFP; Manufacturer: STMicroelectronics; Number Of Adc Channels: 10; Min Supply Voltage: 1.65V; Number Of I2C Channels: 1; Data Bus Width: 32bits; Number Of Timers/Counters: 8; Standoff Height: 0.05mm; Memory Size: 16KBytes; Max Junction Temp: +105°C; Number Of I/Os: 26; Number Of Uart Channels: 2; Interface: I2C,SPI,UART,USART,IrDA; Ram Size: 2KBytes; Frequency: 32MHz; Nominal Supply Current: 500-1500uA; Max Supply Voltage: 3.6V; Core Architecture: Arm Cortex-M0+; Temperature Range Low: -40°C; Package: LQFP32-5V; Lead Free: Yes; Number Of Spi Channels: 1; Number Of A/D Converters: 1; Ambient Temperature Range Low: -40°C; Automotive: No; Category: IC; ComponentLink2URL: https://www.st.com/content/ccc/resource/technical/document/datasheet/42/c0/ab/e5/71/7a/47/0b/DM00206508.pdf/files/DM00206508.pdf/jcr:content/translations/en.DM00206508.pdf; Device Class L3: Microcontrollers; Mouser Description: ARM Microcontrollers - MCU Ultra-low-power ARM Cortex-M0+ MCU with 16-Kbytes Flash, 32 MHz CPU; Number Of Cores: 1; Device Class L2: Embedded Processors and Controllers; Height: 1.6mm; Memory Type: FLASH; Device Class L1: Integrated Circuits (ICs); Digikey Description: IC MCU 32BIT 16KB FLASH 32LQFP; RoHS: TRUE; Ipc Land Pattern Name: QFP80P900X900X160-32; Ambient Temperature Range High: +85°C; Temperature Range High: +85°C; Octopart: https://octopart.com/stm32l011k4t6-stmicroelectronics-71108062; ComponentLink2Description: Datasheet; Temperature: -40°C to +85°C

## Sheet Ancillaries.SchDoc
size A3; SheetNumber: 3; SheetTotal: 5
Used 2 times, as channels Microcontroller_P/U_Ancillaries, Microcontroller_S/U_Ancillaries. Parts and nets are listed once, with the designators drawn on the sheet.
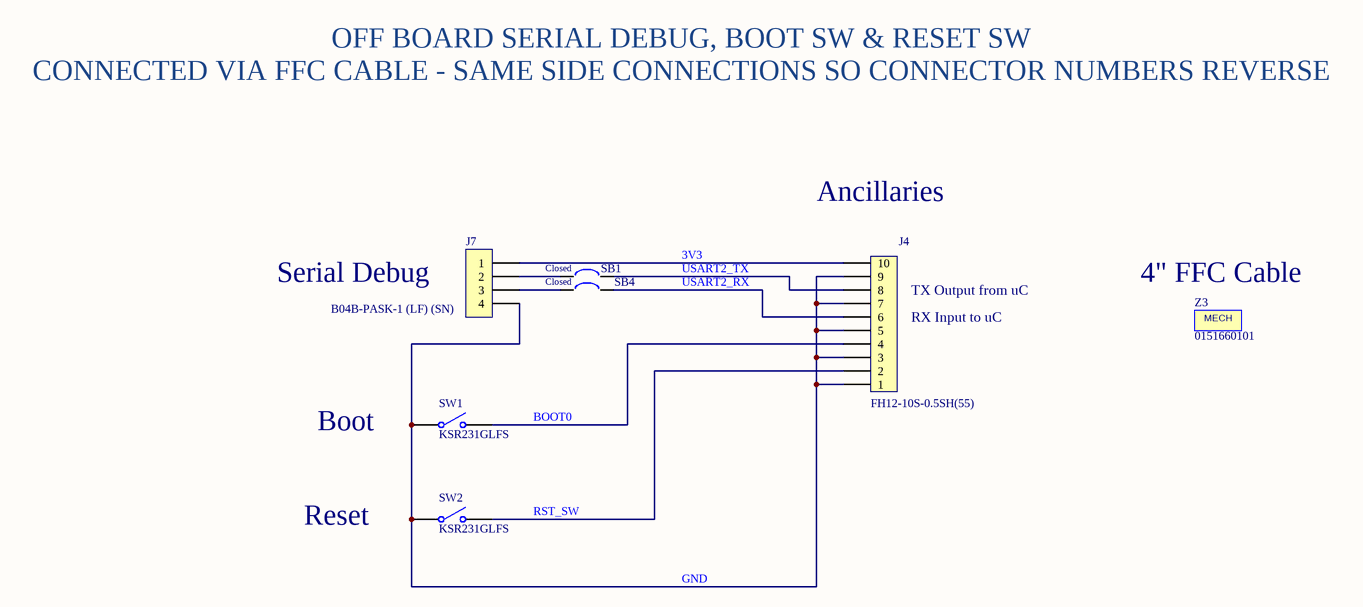
[diagram p2: Ancillaries.SchDoc]

### Parts
J4  Ancillaries  ManuPartNo: FH12-10S-0.5SH(55)  [FH12-10S-0_5SH]
J7  Serial Debug  ManuPartNo: B04B-PASK-1 (LF) (SN)  [B04B-PASK-1]
SB1  Solder Blob Closed  [0603SolderLinkClosed]  (value not drawn)  (no BOM)
SB4  Solder Blob Closed  [0603SolderLinkClosed]  (value not drawn)  (no BOM)
SW1  Boot  ManuPartNo: KSR231GLFS  [SW_KSR]
SW2  Reset  ManuPartNo: KSR231GLFS  [SW_KSR]
Z3  4" FFC Cable  ManuPartNo: 0151660101  (mechanical)

### Nets
NetJ4_1: J4.1 J4.3 J4.5 J4.7 J4.9 J7.4 SW1.1(COMMON) SW2.1(COMMON)
NetJ4_2: J4.2 SW2.2(NO)
NetJ4_4: J4.4 SW1.2(NO)
NetJ4_6: J4.6 SB4.2
NetJ4_8: J4.8 SB1.2
NetJ4_10: J4.10 J7.1
NetJ7_2: J7.2 SB1.1
NetJ7_3: J7.3 SB4.1

### Channels
Microcontroller_P/U_Ancillaries: designators end in A
Microcontroller_S/U_Ancillaries: designators end in B

### Notes on the sheet
- OFF BOARD SERIAL DEBUG, BOOT SW & RESET SW
  CONNECTED VIA FFC CABLE - SAME SIDE CONNECTIONS SO CONNECTOR NUMBERS REVERSE
- 3V3
- USART2_TX
- USART2_RX
- (near J4) TX Output from uC
- (near J4) RX Input to uC
- BOOT0
- RST_SW
- GND
- ©
- CAD:
- Altium Designer
- Changed by:
- Drawing No:
- Change date:
- Title:
- Sub-Title:
- Project Sunride
  The Diamond
  32 Leavygreave Rd
  Broomhall, Sheffield
  United Kingdom
  S3 7RD
- THIS DRAWING REMAINS THE PROPERTY OF PROJECT SUNRIDE.
  COPYRIGHT FOR ALL PURPOSES IS VESTED IN PROJECT SUNRIDE.
  THE REPRODUCTION OF THIS DRAWING IN WHOLE OR IN PART IS PROHIBITED WITHOUT EXPRESS CONSENT IN WRITING. THIS DESIGN IS OFFERED FOR USE ONLY WITH EQUIPMENT MANUFACTURED OR SPECIFICALLY RECOMMENDED BY PROJECT SUNRIDE. RIGHTS ARE RESERVED TO MAKE A CHARGE FOR THE USE OF THIS DESIGN OR ANY PART THEREOF AND SUCH RIGHT SHALL SUBSIST UNLESS AND UNTIL THE SAME SHALL BE EXPRESSLY WAIVED IN WRITING. ACCEPTANCE OF THIS DRAWING WILL BE CONSTRUED AS AN ACCEPTANCE OF THESE CONDITIONS.
- Size:
- A3
- Change reason:
- Sheet
- of
- Variant:
- (in symbol Solder Blob Closed) Closed

### Library data of the parts
J4 = FEC1324540: as J5 on sheet Microcontroller; Source: FEC1324540; Pin Count: 10; Supplier 1: Farnell; Supplier Part Number 1: 1324540; Class: Connector; RoHS: Y; Created: 28/02/2020; Last_Updated: 28/02/2020; ComponentLink1Description: Datasheet; ComponentLink1URL: C:\Altium SANDBOX\Component Database\Datasheet\Hirose FH12 Series.pdf
J7 = RS512-8608: Connector 4 Way Vertical JST B04B-PASK-1 (LF) (SN) 2mm Pitch; Cost 1+: 0.26; Cost 1K+: 0.24; Life: V; Source: RS512-8608; Pin Count: 4; Orient: Vertical; Manufacturer: JST; Supplier 1: RSComponents; Supplier Part Number 1: 512-8608; Pitch: 2mm; Class: Connector; RoHS: Y; Created: 05/06/2013; Last_Updated: 05/06/2013
SB1 SB4 = Solder Blob Closed: as SB2 on sheet Microcontroller; Source: Solder Blob Closed; Pin Count: 2; RoHS: Y; Created: 13/10/2017; Last_Updated: 13/10/2017
SW1 SW2 = FEC120-1422: Switch SMD SPST-NO Vertical ITT/Cannon KSR231GLFS; Cost 1+: 0.77; Cost 1K+: 0.54; Life: V; Source: FEC120-1422; Switch Type: SPST-NO; Orient: Vertical; Manufacturer: ITT/Cannon; Supplier 1: Farnell; Supplier Part Number 1: 1201422; Class: Switch SMD; RoHS: Y; Created: 18/09/2013; Last_Updated: 18/09/2013
Z3 = DigiKeyWM11300-ND: CABLE FFC/FPC 10POS 0.5MM 4"; Manufacturer: Molex; Cost 1+: 1.67; Cost 1K+: 1.26; Life: V; Source: DigiKeyWM11300-ND; Supplier 1: Digi-Key; Supplier Part Number 1: WM11300-ND; RoHS: Y; Created: 02/11/2025; Last_Updated: 02/11/2025; ComponentLink1Description: Datasheet; ComponentLink1URL: C:\Altium SANDBOX\Component Database\Datasheet\PS-15166-001-001.pdf

## Sheet Output Stages.SchDoc
size A3; SheetNumber: 4; SheetTotal: 5
Used 4 times, as channels U_Output Stages_P1, U_Output Stages_P2, U_Output Stages_S1, U_Output Stages_S2. Parts and nets are listed once, with the designators drawn on the sheet.
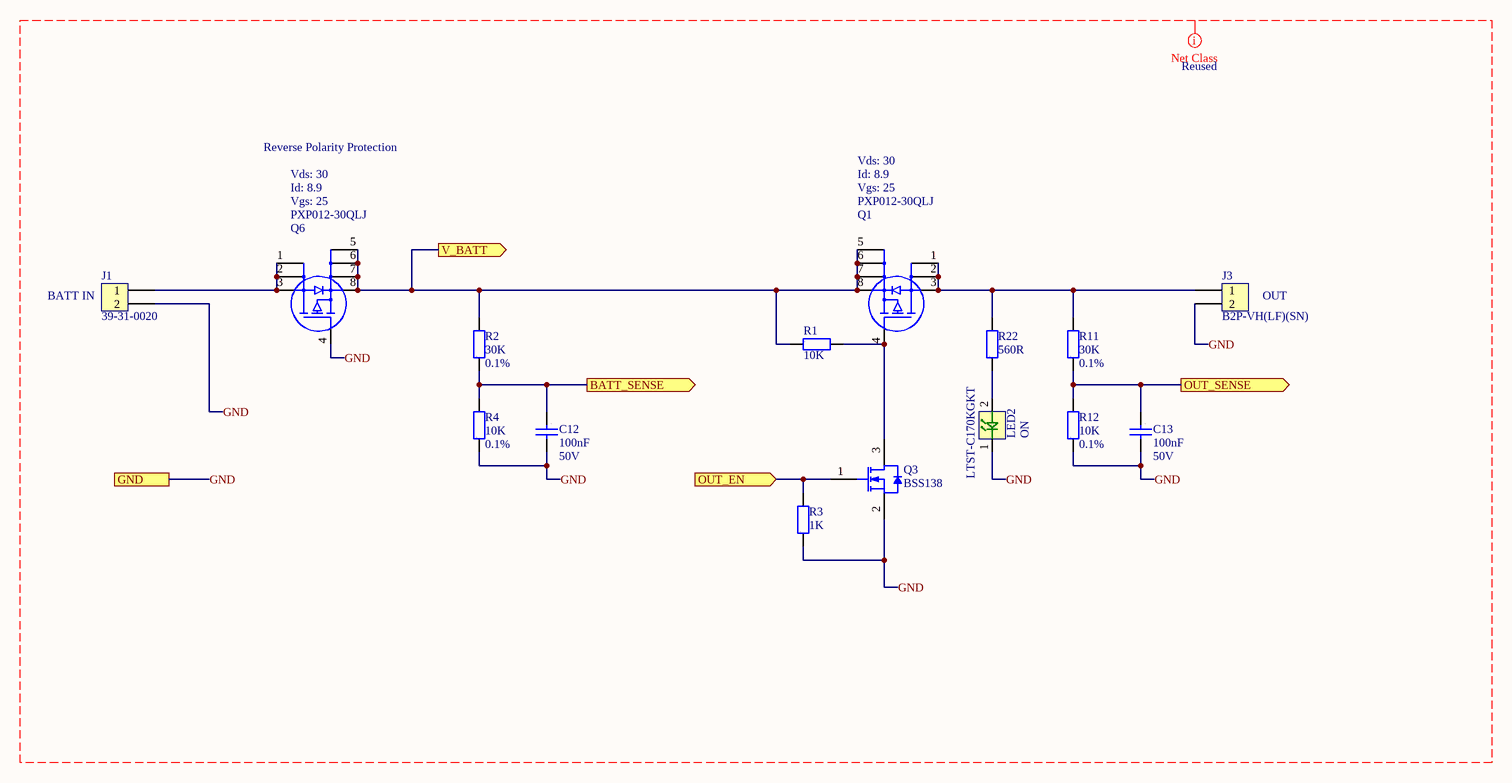
[diagram p3: Output Stages.SchDoc]

### Parts
C12  value 100nF  Voltage: 50V  [CAPC1608X08L]  (hidden comment: *)
C13  value 100nF  Voltage: 50V  [CAPC1608X08L]  (hidden comment: *)
J1  BATT IN  [39-31-0020]
J3  OUT  ManuPartNo: B2P-VH(LF)(SN)  [B2P-VH]
LED2  ON  ManuPartNo: LTST-C170KGKT  [CAPCP2012X11N]
Q1  ManuPartNo: PXP012-30QLJ  Vds: 30  Id: 8.9  Vgs: 25  [MLPAK33_SOT8002-1_NEX-M]  (hidden comment: *)
Q3  BSS138  [FAIR-SOT23-3_V]
Q6  Reverse Polarity Protection  ManuPartNo: PXP012-30QLJ  Vds: 30  Id: 8.9  Vgs: 25  [MLPAK33_SOT8002-1_NEX-M]
R1  value 10K  [RESC1608X06L]  (hidden comment: RESISTOR)
R2  value 30K  Tolerance: 0.1%  [RESC1608X06L]  (hidden comment: *)
R3  value 1K  [RESC1608X06L]  (hidden comment: RESISTOR)
R4  value 10K  Tolerance: 0.1%  [RESC1608X06L]  (hidden comment: *)
R11  value 30K  Tolerance: 0.1%  [RESC1608X06L]  (hidden comment: *)
R12  value 10K  Tolerance: 0.1%  [RESC1608X06L]  (hidden comment: *)
R22  value 560R  [RESC1608X06L]  (hidden comment: *)

### Ports
BATT_SENSE (out), GND, OUT_EN (in), OUT_SENSE (out), V_BATT (out)

### Nets
BATT_SENSE: C12.1 R2.1 R4.2 ; port BATT_SENSE
GND: C12.2 C13.2 J1.2 J3.2 LED2.1 Q3.2(S) Q6.4(Gate) R3.1 R4.1 R12.1 ; port GND
OUT_EN: Q3.1(G) R3.2 ; port OUT_EN
OUT_SENSE: C13.1 R11.1 R12.2 ; port OUT_SENSE
V_BATT: Q1.5(Source) Q1.6(Source) Q1.7(Source) Q1.8(Source) Q6.5(Source) Q6.6(Source) Q6.7(Source) Q6.8(Source) R1.1 R2.2 ; port V_BATT
NetJ1_1: J1.1 Q6.1(Drain) Q6.2(Drain) Q6.3(Drain)
NetJ3_1: J3.1 Q1.1(Drain) Q1.2(Drain) Q1.3(Drain) R11.2 R22.2
NetLED2_2: LED2.2 R22.1
NetQ1_4: Q1.4(Gate) Q3.3(D) R1.2

### Channels
U_Output Stages_P1: designators end in A; ports BATT_SENSE=PRIMARY_VBATT_SENSE_1 GND=GND OUT_EN=PRIMARY_OUT_EN_1 OUT_SENSE=PRIMARY_OUT_SENSE_1 V_BATT=PRIMARY_VBATT_1
U_Output Stages_P2: designators end in B; ports BATT_SENSE=PRIMARY_VBATT_SENSE_2 GND=GND OUT_EN=PRIMARY_OUT_EN_2 OUT_SENSE=PRIMARY_OUT_SENSE_2 V_BATT=PRIMARY_VBATT_2
U_Output Stages_S1: designators end in C; ports BATT_SENSE=SECONDARY_VBATT_SENSE_1 GND=GND OUT_EN=SECONDARY_OUT_EN_1 OUT_SENSE=SECONDARY_OUT_SENSE_1 V_BATT=SECONDARY_VBATT_1
U_Output Stages_S2: designators end in D; ports BATT_SENSE=SECONDARY_VBATT_SENSE_2 GND=GND OUT_EN=SECONDARY_OUT_EN_2 OUT_SENSE=SECONDARY_OUT_SENSE_2 V_BATT=SECONDARY_VBATT_2

### Layout directives
net class Reused: GND

### Notes on the sheet
- ©
- CAD:
- Altium Designer
- Changed by:
- Drawing No:
- Change date:
- Title:
- Sub-Title:
- Project Sunride
  The Diamond
  32 Leavygreave Rd
  Broomhall, Sheffield
  United Kingdom
  S3 7RD
- THIS DRAWING REMAINS THE PROPERTY OF PROJECT SUNRIDE.
  COPYRIGHT FOR ALL PURPOSES IS VESTED IN PROJECT SUNRIDE.
  THE REPRODUCTION OF THIS DRAWING IN WHOLE OR IN PART IS PROHIBITED WITHOUT EXPRESS CONSENT IN WRITING. THIS DESIGN IS OFFERED FOR USE ONLY WITH EQUIPMENT MANUFACTURED OR SPECIFICALLY RECOMMENDED BY PROJECT SUNRIDE. RIGHTS ARE RESERVED TO MAKE A CHARGE FOR THE USE OF THIS DESIGN OR ANY PART THEREOF AND SUCH RIGHT SHALL SUBSIST UNLESS AND UNTIL THE SAME SHALL BE EXPRESSLY WAIVED IN WRITING. ACCEPTANCE OF THIS DRAWING WILL BE CONSTRUED AS AN ACCEPTANCE OF THESE CONDITIONS.
- Size:
- A3
- Change reason:
- Sheet
- of
- Variant:

### Library data of the parts
C12 C13 = FEC882-0023: as C14 on sheet Top Sheet; Source: FEC882-0023; Dielectric: X7R; Supplier 1: Farnell; Supplier Part Number 1: 8820023; Tolerance: 10%; Class: Capacitor MLC; RoHS: Y; Created: 25/01/2013; Last_Updated: 25/01/2013
J1 = FEC1756696: Connector 2 Way Mini-Fit 5566 Series; Manufacturer: Molex; Orient: Vertical; Cost 1+: 0.39; Cost 1K+: 0.283; Life: V; Source: FEC1756696; ManuPartNo: 39-31-0020; Pin Count: 2; Supplier 1: Farnell; Supplier Part Number 1: 1756696; Class: Connector; RoHS: Y; Created: 06/02/2018; Last_Updated: 06/02/2018; ComponentLink1Description: Datasheet; ComponentLink1URL: C:\Altium SANDBOX\Component Database\Datasheet\39-31-0020.pdf
J3 = FEC949-2003: Connector 2 Way Vertical JST B2P-VH(LF)(SN) 3.96mm Pitch; Cost 1+: 0.128; Cost 1K+: 0.074; Life: V; Source: FEC949-2003; Pin Count: 2; Orient#: Vertical; Manufacturer: JST; Supplier 1: Farnell; Supplier Part Number 1: 9492003; Pitch: 3.96mm; Class: Connector; RoHS: Y; Created: 13/06/2013; Last_Updated: 13/06/2013
LED2 = RS692-0907: LED 2.0x1.25mm GREEN 0805 LTST-C170KGKT; Manufacturer: Liteon; IF Max (mA): 80; IF Typ (mA): 30; View Angle: 130; Cost 1+: 0.169; Cost 1K+: 0.071; Class: LED 0805 Green; Life: V; Source: RS692-0907; RoHS: Y; Created: 05/08/2013; Last_Updated: 05/08/2013; ComponentLink1Description: Datasheet; ComponentLink1URL: C:\Altium SANDBOX\Component Database\Datasheet\LTST-C170KGKT.pdf; Supplier 1: RSComponents; Supplier Part Number 1: 692-0907
Q1 Q6 = FEC3934789: Power MOSFET, P Channel, 30 V, 15.2 A, 0.0111 ohm, MLPAK33, Surface Mount; Manufacturer: NEXPERIA; Rds(on): 0.0111; Pd (mW): 1700; Cost 1+: 0.598; Cost 1K+: 0.207; Class: Transistor MOSFET P; Source: FEC3934789; Supplier 1: Farnell; Supplier Part Number 1: 3934789; RoHS: Y; Life: V; Created: 24/09/2025; Last_Updated: 24/09/2025; ComponentLink1Description: Datasheet; ComponentLink1URL: C:\Altium SANDBOX\Component Database\Datasheet\3679934.pdf
Q3 = CMP-013-00021-3: N-Channel Logic Level Enhancement Mode Field Effect Transistor, 220 mA, 50 V, -55 to 150 degC, 3-Pin SOT-23, RoHS, Tape and Reel; Manufacturer: Fairchild; Resistance: 0.7Ohm; Rds On Max: 3.5Ohm; Typical Rise Time: 9ns; Power: 360mW; Elements: 1; Input Capacitance: 27pF; Package Version: Rev. 12, 03/2016; Nominal Vgs: 1.3V; Nominal Dual Supply Voltage: 50V; Pins: 3; Package Description: 3-Pin Small Outline Transistor, Body 2.92 x 1.325 mm, Pitch 0.95 mm; Datasheet Version: Rev. C, 10/2005; Mounting Technology: SM; Package Quantity: 1; Case/Package: TO-236-3; RoHS Compliant: True; Max Operating Temperature: 150°C; Package Reference: SOT23-3; Min Operating Temperature: -55°C; Datasheet URL: https://www.fairchildsemi.com/datasheets/BS/BSS138.pdf; Packaging: TapeandReel
R1 = PanasonicERA3AEB103V: as R10 on sheet Microcontroller; Source: PanasonicERA3AEB103V; Manufacturer: Panasonic; ManuPartNo: ERA3AEB103V; Supplier 1: Farnell; Supplier Part Number 1: 1577619; Tolerance: 0.1%; Class: Resistor; RoHS: Y; Life: V; Created: 27/02/2018; Last_Updated: 27/02/2018; ComponentLink1Description: Datasheet; ComponentLink1URL: C:\Altium SANDBOX\Component Database\Datasheet\Panasonic Resistors.pdf
R2 R11 = PanasonicERA3AEB303V: SMD Chip Resistor, Thin Film, 30 kohm, 75 V, 0603 [1608 Metric], 100 mW, ± 0.1%, ERA3A Series; Voltage: 75V; Power: 100mW; Cost 1+: 0.0538; Cost 1K+: 0.0349; Source: PanasonicERA3AEB303V; Manufacturer: Panasonic; ManuPartNo: ERA3AEB303V; Supplier 1: Farnell; Supplier Part Number 1: 1670196; Class: Resistor; RoHS: Y; Life: V; Created: 19/09/2025; Last_Updated: 19/09/2025; ComponentLink1Description: Datasheet; ComponentLink1URL: C:\Altium SANDBOX\Component Database\Datasheet\Panasonic Resistors.pdf
R3 = FEC2421849: SMD Chip Resistor, Thick Film, 1 kohm, 50 V, 0603 [1608 Metric], 100 mW, ± 1%, RC Series; Manufacturer: Yageo; ManuPartNo: RC0603FR-071KL; Voltage: 50V; Cost 1+: 0.002; Cost 1K+: 0.001; Power: 100mW; Source: FEC2421849; Supplier 1: Farnell; Supplier Part Number 1: 2421849; Tolerance: 1%; Class: Resistor; RoHS: Y; Life: V; Created: 22/05/2018; Last_Updated: 22/05/2018; ComponentLink1Description: Datasheet; ComponentLink1URL: C:\Altium SANDBOX\Component Database\Datasheet\Yageo RC_L Series.pdf
R4 R12 = PanasonicERA3AEB103V: SMD Chip Resistor, Thin Film, 10 kohm, 75 V, 0603 [1608 Metric], 100 mW, ± 0.1%, ERA3A Series; Voltage: 75V; Power: 100mW; Cost 1+: 0.237; Cost 1K+: 0.053; Source: PanasonicERA3AEB103V; Manufacturer: Panasonic; ManuPartNo: ERA3AEB103V; Supplier 1: Farnell; Supplier Part Number 1: 1577619; Class: Resistor; RoHS: Y; Life: V; Created: 27/02/2018; Last_Updated: 27/02/2018; ComponentLink1Description: Datasheet; ComponentLink1URL: C:\Altium SANDBOX\Component Database\Datasheet\Panasonic Resistors.pdf
R22 = FEC933-1344: Resistor 560R 1% 50V RESC1608X06M; Manufacturer: Multicomp; ManuPartNo: MC 0.063W 0603 1% 560R; Cost 1+: 0.021; Cost 1K+: 0.015; Life: V; Source: FEC933-1344; Voltage: 50V; Supplier 1: Farnell; Supplier Part Number 1: 9331344; Tolerance: 1%; Class: Resistor; RoHS: Y; Created: 23/01/2013; Last_Updated: 23/01/2013

## Sheet CAN Adaptor.SchDoc
size A3; SheetNumber: 5; SheetTotal: 5
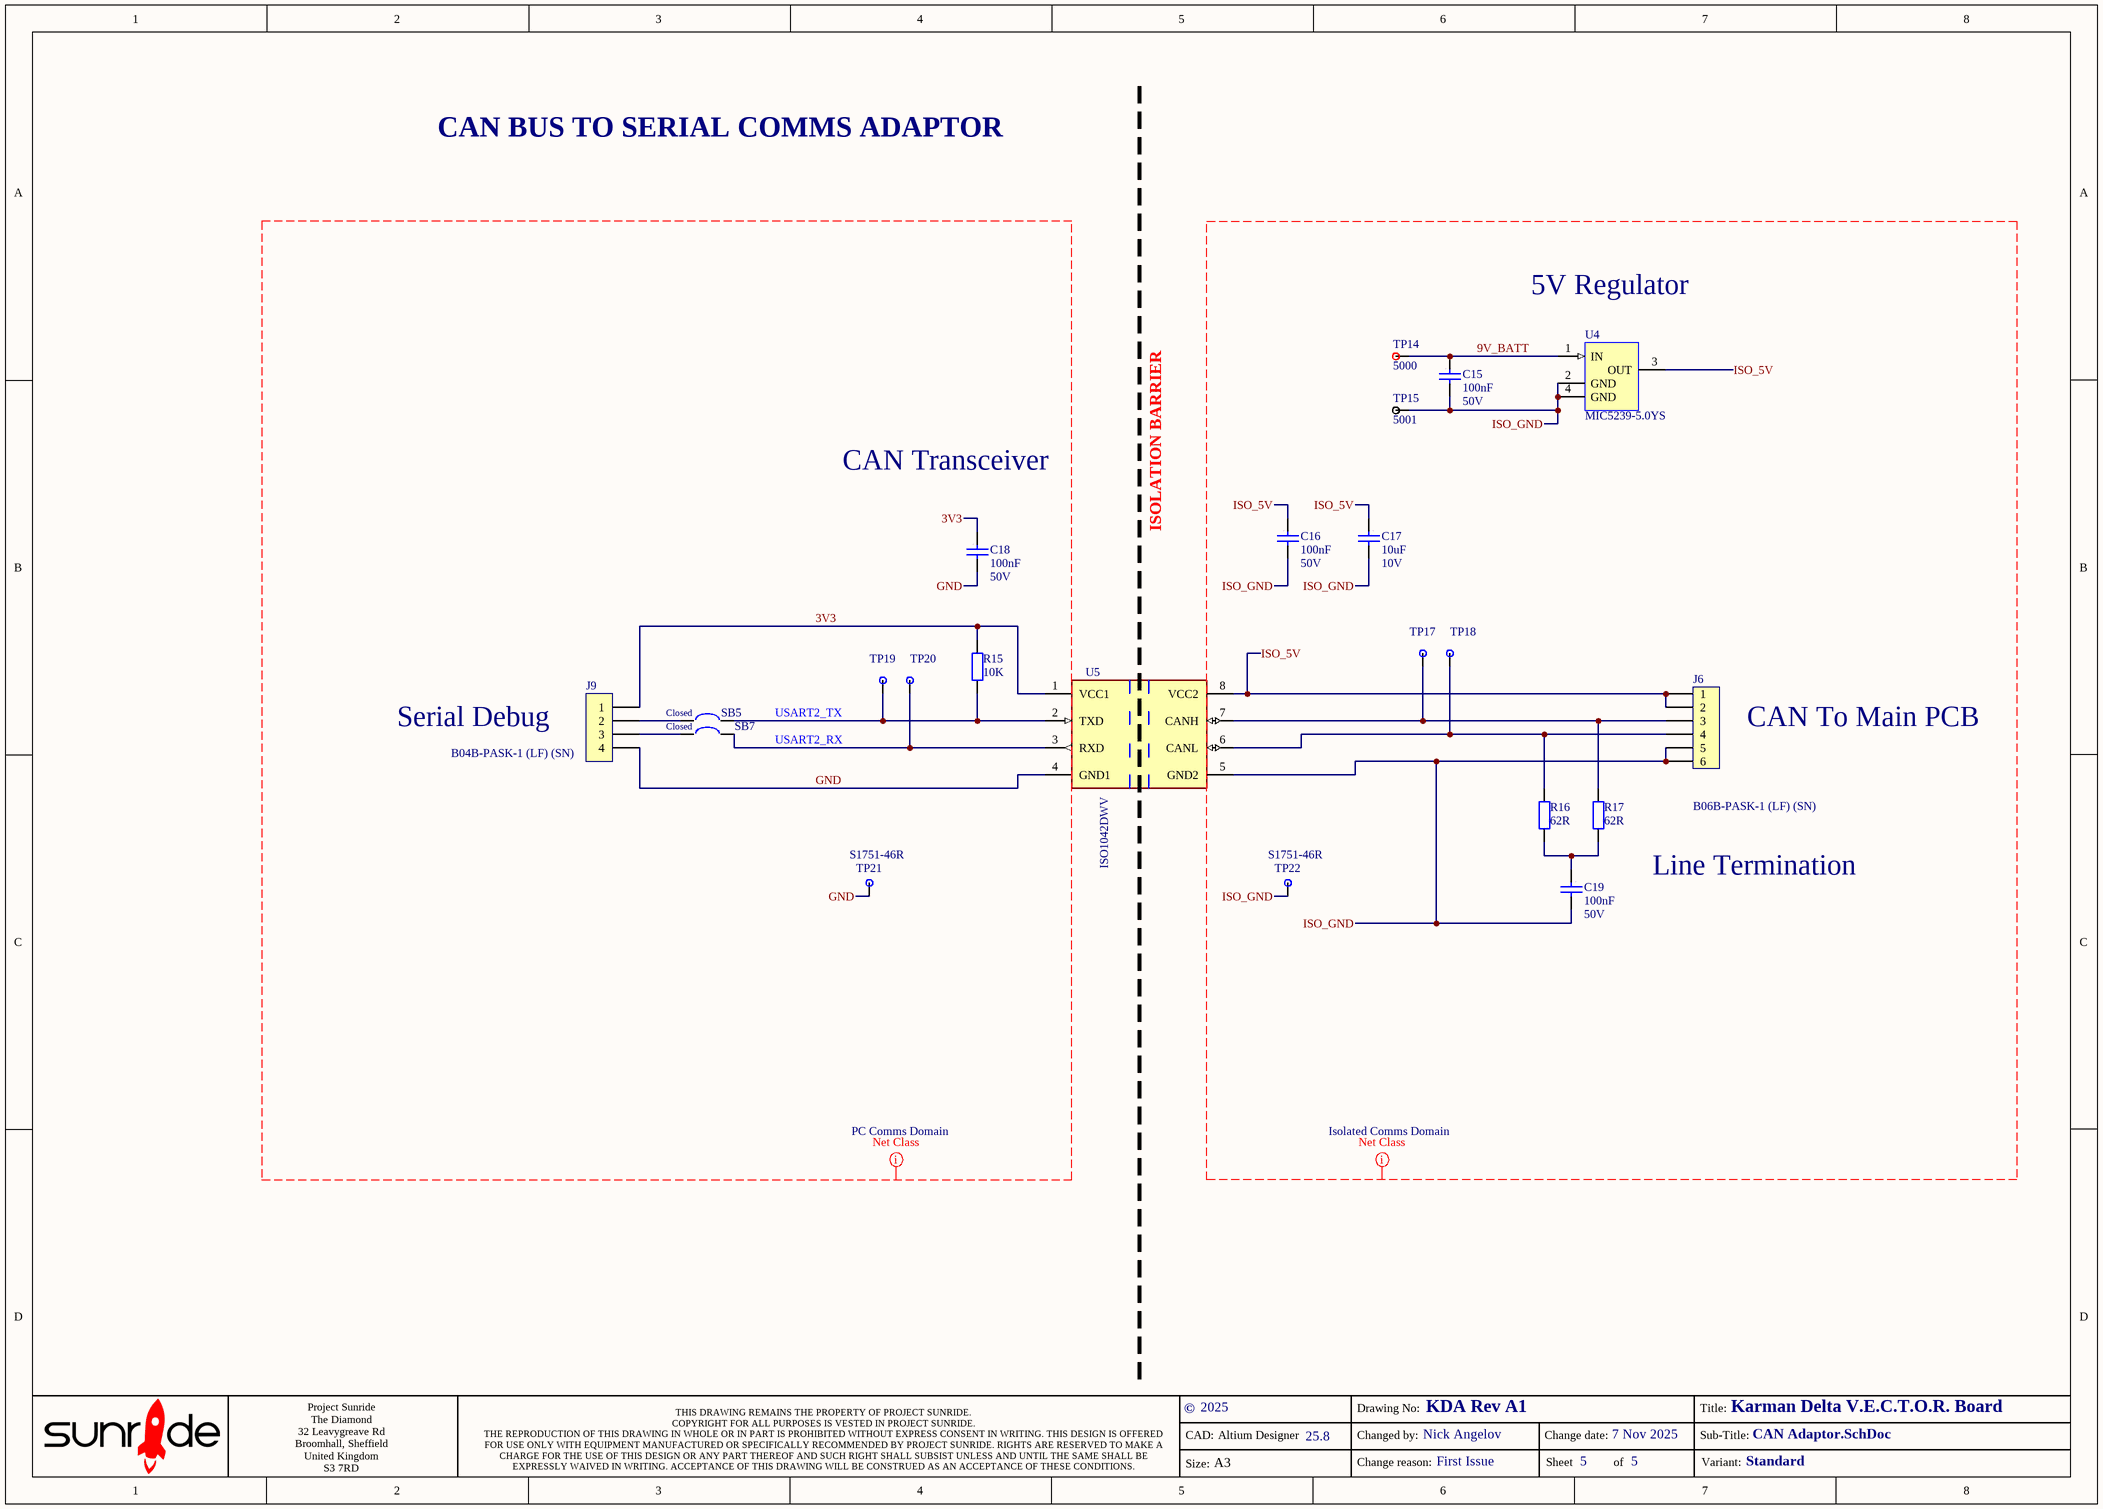
[diagram p4: CAN Adaptor.SchDoc]

### Parts
C15  value 100nF  Voltage: 50V  [CAPC1608X08L]  (hidden comment: *)
C16  value 100nF  Voltage: 50V  [CAPC1608X08L]  (hidden comment: *)
C17  value 10uF  Voltage: 10V  [CAPC2012X15M]  (hidden comment: *)
C18  value 100nF  Voltage: 50V  [CAPC1608X08L]  (hidden comment: *)
C19  value 100nF  Voltage: 50V  [CAPC1608X08L]  (hidden comment: *)
J6  CAN To Main PCB  ManuPartNo: B06B-PASK-1 (LF) (SN)  [B06B-PASK-1]
J9  Serial Debug  ManuPartNo: B04B-PASK-1 (LF) (SN)  [B04B-PASK-1]
R15  value 10K  [RESC1608X06L]  (hidden comment: RESISTOR)
R16  value 62R  [RESC1608X06L]  (hidden comment: *)
R17  Line Termination  value 62R  [RESC1608X06L]
SB5  Solder Blob Closed  [0603SolderLinkClosed]  (value not drawn)  (no BOM)
SB7  Solder Blob Closed  [0603SolderLinkClosed]  (value not drawn)  (no BOM)
TP14  ManuPartNo: 5000  [POST-Red]  (hidden comment: +9V)
TP15  ManuPartNo: 5001  [POST-Black]  (hidden comment: 0V)
TP17  TMS  [TP1]  (value not drawn)  (no BOM)
TP18  TMS  [TP1]  (value not drawn)  (no BOM)
TP19  TMS  [TP1]  (value not drawn)  (no BOM)
TP20  TMS  [TP1]  (value not drawn)  (no BOM)
TP21  GND  [S1751-46R]  (value not drawn)
TP22  GND  [S1751-46R]  (value not drawn)
U4  5V Regulator  ManuPartNo: MIC5239-5.0YS  [SOT230P700X170-4M]
U5  CAN Transceiver  Manuf Part No: ISO1042DWV  [FP-DWV0008A-IPC_C]

### Nets
3V3: C18.1 J9.1 R15.2 U5.1(VCC1)
9V_BATT: C15.1 TP14.1 U4.1(IN)
GND: C18.2 J9.4 TP21.1 U5.4(GND1)
ISO_5V: C16.1 C17.1 J6.1 J6.2 U4.3(OUT) U5.8(VCC2)
ISO_GND: C15.2 C16.2 C17.2 C19.2 J6.5 J6.6 TP15.1 TP22.1 U4.2(GND) U4.4(GND) U5.5(GND2)
NetC19_1: C19.1 R16.1 R17.1
NetJ6_3: J6.3 R17.2 TP17.1 U5.7(CANH)
NetJ6_4: J6.4 R16.2 TP18.1 U5.6(CANL)
NetJ9_2: J9.2 SB5.1
NetJ9_3: J9.3 SB7.1
NetR15_1: R15.1 SB5.2 TP19.1 U5.2(TXD)
NetSB7_2: SB7.2 TP20.1 U5.3(RXD)

### Layout directives
net class PC Comms Domain: 3V3, GND
net class Isolated Comms Domain: 9V_BATT, ISO_5V, ISO_GND

### Notes on the sheet
- CAN BUS TO SERIAL COMMS ADAPTOR
- ISOLATION BARRIER
- USART2_TX
- USART2_RX
- ©
- CAD:
- Altium Designer
- Changed by:
- Drawing No:
- Change date:
- Title:
- Sub-Title:
- Project Sunride
  The Diamond
  32 Leavygreave Rd
  Broomhall, Sheffield
  United Kingdom
  S3 7RD
- THIS DRAWING REMAINS THE PROPERTY OF PROJECT SUNRIDE.
  COPYRIGHT FOR ALL PURPOSES IS VESTED IN PROJECT SUNRIDE.
  THE REPRODUCTION OF THIS DRAWING IN WHOLE OR IN PART IS PROHIBITED WITHOUT EXPRESS CONSENT IN WRITING. THIS DESIGN IS OFFERED FOR USE ONLY WITH EQUIPMENT MANUFACTURED OR SPECIFICALLY RECOMMENDED BY PROJECT SUNRIDE. RIGHTS ARE RESERVED TO MAKE A CHARGE FOR THE USE OF THIS DESIGN OR ANY PART THEREOF AND SUCH RIGHT SHALL SUBSIST UNLESS AND UNTIL THE SAME SHALL BE EXPRESSLY WAIVED IN WRITING. ACCEPTANCE OF THIS DRAWING WILL BE CONSTRUED AS AN ACCEPTANCE OF THESE CONDITIONS.
- Size:
- A3
- Change reason:
- Sheet
- of
- Variant:
- (in symbol Solder Blob Closed) Closed

### Library data of the parts
C15 C16 C18 C19 = FEC882-0023: as C14 on sheet Top Sheet; Source: FEC882-0023; Dielectric: X7R; Tolerance: 10%; Class: Capacitor MLC; RoHS: Y; Created: 25/01/2013; Last_Updated: 25/01/2013; Supplier 1: Farnell; Supplier Part Number 1: 8820023
C17 = Mouser81-GRM21BR71A106KE51: as C6 on sheet Microcontroller; Source: Mouser81-GRM21BR71A106KE51; Dielectric: X7R; Supplier 1: Mouser; Supplier Part Number 1: 81-GRM21BR71A106KE51; Tolerance: 10%; Class: Capacitor MLC; RoHS: Y; Created: 21/12/2016; Last_Updated: 21/12/2016
J6 = FEC183-0743: as J2 on sheet Top Sheet; Source: FEC183-0743; Pin Count: 6; Orient: Vertical; Supplier 1: Farnell; Supplier Part Number 1: 1830743; Pitch: 2mm; Class: Connector; RoHS: Y; Created: 21/06/2013; Last_Updated: 21/06/2013
J9 = RS512-8608: as J7 on sheet Ancillaries; Source: RS512-8608; Pin Count: 4; Orient: Vertical; Manufacturer: JST; Supplier 1: RSComponents; Supplier Part Number 1: 512-8608; Pitch: 2mm; Class: Connector; RoHS: Y; Created: 05/06/2013; Last_Updated: 05/06/2013
R15 = PanasonicERA3AEB103V: as R10 on sheet Microcontroller; Source: PanasonicERA3AEB103V; Manufacturer: Panasonic; ManuPartNo: ERA3AEB103V; Supplier 1: Farnell; Supplier Part Number 1: 1577619; Tolerance: 0.1%; Class: Resistor; RoHS: Y; Life: V; Created: 27/02/2018; Last_Updated: 27/02/2018; ComponentLink1Description: Datasheet; ComponentLink1URL: C:\Altium SANDBOX\Component Database\Datasheet\Panasonic Resistors.pdf
R16 R17 = Mouser603-RC0603FR-0762RL: as R13 on sheet Top Sheet; Source: Mouser603-RC0603FR-0762RL; Voltage: 75V; Power: 100mW; ManuPartNo: RC0603FR-0762RL; Supplier 1: Mouser; Supplier Part Number 1: 603-RC0603FR-0762RL; Tolerance: 1%; Class: Resistor; RoHS: Y; Created: 08/06/2018; Last_Updated: 08/06/2018; ComponentLink1Description: Datasheet; ComponentLink1URL: C:\Altium SANDBOX\Component Database\Datasheet\Yageo RC_L Series.pdf
SB5 SB7 = Solder Blob Closed: as SB2 on sheet Microcontroller; Source: Solder Blob Closed; Pin Count: 2; RoHS: Y; Created: 13/10/2017; Last_Updated: 13/10/2017
TP14 = FEC146-3076: Connector Test Point Red Keystone 5000; Orient: Vertical; Cost 1+: 0.2489; Life: V; Source: FEC146-3076; Pin Count: 1; Manufacturer: Keystone; Cost 1K+: 0.2489; Supplier 1: Farnell; Supplier Part Number 1: 1463076; Class: Connector; RoHS: Y; Created: 30/05/2013; Last_Updated: 16/12/2015
TP15 = FEC146-3077: Connector Test Point Black Keystone 5001; Orient: Vertical; Cost 1+: 0.2489; Life: V; Source: FEC146-3077; Pin Count: 1; Manufacturer: Keystone; Cost 1K+: 0.2489; Supplier 1: Farnell; Supplier Part Number 1: 1463077; Class: Connector; RoHS: Y; Created: 30/05/2013; Last_Updated: 16/12/2015
TP17-TP20 = Misc TP1: as TP3 on sheet Microcontroller; Source: Misc TP1; Class: Testpoint; Created: 26/01/2013; Last_Updated: 26/01/2013; Supplier 1: Misc; Supplier Part Number 1: TP1
TP21 TP22 = FEC2293786: as TP1 on sheet Microcontroller; Source: FEC2293786; ManuPartNo: S1751-46R; Pin Count: 1; Supplier 1: Farnell; Supplier Part Number 1: 2293786; RoHS: Y; Created: 16/10/2017; Last_Updated: 01/12/2017; ComponentLink1Description: Datasheet; ComponentLink1URL: C:\Altium SANDBOX\Component Database\Datasheet\S1751-46R.pdf
U4 = FEC210-0330: IC Regulator LDO MIC5239-5.0YS SOT-223; Manufacturer: Micrel; Cost 1+: 3.22; Cost 1K+: 1.3; Class: IC LDO Regulator; Life: V; Source: FEC210-0330; Supplier 1: Farnell; Supplier Part Number 1: 2100330; RoHS: Y; Created: 23/01/2014; Last_Updated: 23/01/2014; ComponentLink1Description: Datasheet; ComponentLink1URL: C:\Altium SANDBOX\Component Database\Datasheet\MIC5239.pdf
U5 = CMP-04872-000132-1: IC TRANSCEIVER FULL 1/1 8SOIC; RoHS Compliant: Yes

## Nets that join several sheets
CANH: Top Sheet (J2.3 R13.2), Microcontroller_P (U3A.7), Microcontroller_S (U3B.7)
CANL: Top Sheet (J2.4 R14.2), Microcontroller_P (U3A.6), Microcontroller_S (U3B.6)
GND: Microcontroller_P (24 pins), U_Output Stages_P1 (10 pins), U_Output Stages_P2 (10 pins)
GND: Microcontroller_S (24 pins), U_Output Stages_S1 (10 pins), U_Output Stages_S2 (10 pins)
ISO_5V: Top Sheet (J2.1 J2.2), Microcontroller_P (C5A.1 C6A.1 U3A.8), Microcontroller_S (C5B.1 C6B.1 U3B.8)
ISO_GND: Top Sheet (C14.2 J2.5 J2.6), Microcontroller_P (C5A.2 C6A.2 TP16A.1 U3A.5), Microcontroller_S (C5B.2 C6B.2 TP16B.1 U3B.5)
PRIMARY_OUT_EN_1: Microcontroller_P (U6A.14), U_Output Stages_P1 (Q3A.1 R3A.2)
PRIMARY_OUT_EN_2: Microcontroller_P (U6A.15), U_Output Stages_P2 (Q3B.1 R3B.2)
PRIMARY_OUT_SENSE_1: Microcontroller_P (U6A.12), U_Output Stages_P1 (C13A.1 R11A.1 R12A.2)
PRIMARY_OUT_SENSE_2: Microcontroller_P (U6A.13), U_Output Stages_P2 (C13B.1 R11B.1 R12B.2)
PRIMARY_VBATT_1: Microcontroller_P (D8A.1), U_Output Stages_P1 (10 pins)
PRIMARY_VBATT_2: Microcontroller_P (D8A.2), U_Output Stages_P2 (10 pins)
PRIMARY_VBATT_SENSE_1: Microcontroller_P (U6A.10), U_Output Stages_P1 (C12A.1 R2A.1 R4A.2)
PRIMARY_VBATT_SENSE_2: Microcontroller_P (U6A.11), U_Output Stages_P2 (C12B.1 R2B.1 R4B.2)
SECONDARY_OUT_EN_1: Microcontroller_S (U6B.14), U_Output Stages_S1 (Q3C.1 R3C.2)
SECONDARY_OUT_EN_2: Microcontroller_S (U6B.15), U_Output Stages_S2 (Q3D.1 R3D.2)
SECONDARY_OUT_SENSE_1: Microcontroller_S (U6B.12), U_Output Stages_S1 (C13C.1 R11C.1 R12C.2)
SECONDARY_OUT_SENSE_2: Microcontroller_S (U6B.13), U_Output Stages_S2 (C13D.1 R11D.1 R12D.2)
SECONDARY_VBATT_1: Microcontroller_S (D8B.1), U_Output Stages_S1 (10 pins)
SECONDARY_VBATT_2: Microcontroller_S (D8B.2), U_Output Stages_S2 (10 pins)
SECONDARY_VBATT_SENSE_1: Microcontroller_S (U6B.10), U_Output Stages_S1 (C12C.1 R2C.1 R4C.2)
SECONDARY_VBATT_SENSE_2: Microcontroller_S (U6B.11), U_Output Stages_S2 (C12D.1 R2D.1 R4D.2)